# EAGLE design HDD (EAGLE 7.1.0)
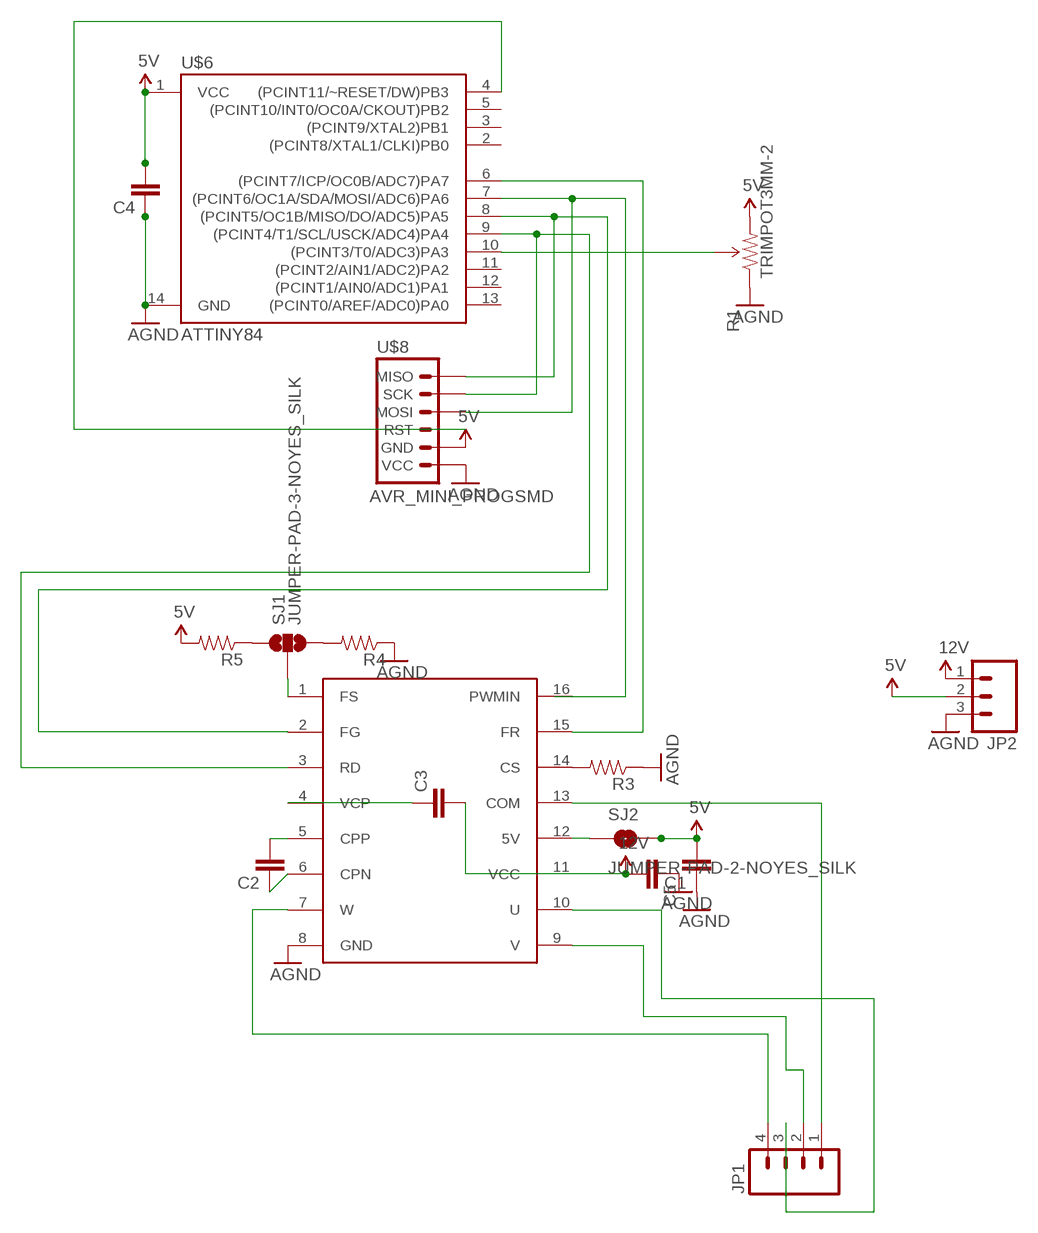
[diagram p0: schematic, sheet 1]

## Parts
C1  CAP0805  [0805]
C2  CAP0805  [0805]
C3  CAP0805  [0805]
C4  CAP0805  [0805]
C5  CAP0805  [0805]
JP1  M04LOCK  [1X04_LOCK]
JP2  M03PTH  [1X03]
R1  TRIMPOT3MM-2  [TRIMPOT-3MM-2]
R3  RESISTOR0805-RES  [0805]
R4  RESISTOR0805-RES  [0805]
R5  RESISTOR0805-RES  [0805]
SJ1  JUMPER-PAD-3-NOYES_SILK  [PAD-JUMPER-3-NO_YES_SILK]
SJ2  JUMPER-PAD-2-NOYES_SILK  [PAD-JUMPER-2-NO_YES_SILK]
U$1  DRV11873  [TSSOP-16]
U$6  ATTINY84  [SO14]
U$8  AVR_MINI_PROGSMD  [AVR_MINI_PROG]

## Nets
5V: C1.2 C4.2 JP2.2 R1.3(CW) R5.2 SJ2.2 U$6.1(VCC) U$8.2(GND)
12V: C3.2 C5.2 JP2.1 U$1.11(VCC)
AGND: C1.1 C4.1 C5.1 JP2.3 R1.1(CCW) R3.1 R4.1 U$1.8(GND) U$6.14(GND) U$8.1(VCC)
N$1: SJ2.1 U$1.12(5V)
N$3: C2.1 U$1.6(CPN)
N$4: C2.2 U$1.5(CPP)
N$5: U$1.2(FG) U$6.8((PCINT5/OC1B/MISO/DO/ADC5)PA5) U$8.6(MISO)
N$6: C3.1 U$1.4(VCP)
N$7: U$1.3(RD) U$6.9((PCINT4/T1/SCL/USCK/ADC4)PA4) U$8.5(SCK)
N$8: R3.2 U$1.14(CS)
N$9: JP1.1 U$1.13(COM)
N$10: JP1.3 U$1.10(U)
N$11: JP1.2 U$1.9(V)
N$12: JP1.4 U$1.7(W)
N$13: U$6.7((PCINT6/OC1A/SDA/MOSI/ADC6)PA6) U$8.4(MOSI)
N$14: U$1.15(FR) U$6.6((PCINT7/ICP/OC0B/ADC7)PA7)
N$15: SJ1.2 U$1.1(FS)
N$16: R4.2 SJ1.3
N$17: R5.1 SJ1.1
N$19: U$6.4((PCINT11/~RESET/DW)PB3) U$8.3(RST)
N$20: R1.2(WIPER) U$6.10((PCINT3/T0/ADC3)PA3)
Unconnected: U$1.16(PWMIN) U$6.2((PCINT8/XTAL1/CLKI)PB0) U$6.3((PCINT9/XTAL2)PB1) U$6.5((PCINT10/INT0/OC0A/CKOUT)PB2) U$6.11((PCINT2/AIN1/ADC2)PA2) U$6.12((PCINT1/AIN0/ADC1)PA1) U$6.13((PCINT0/AREF/ADC0)PA0)

## Library data of the parts
C1-C5 = SparkFun-Capacitors:CAP: Capacitor Standard 0603 ceramic capacitor, and 0.1" leaded capacitor.
JP1 = SparkFun-Connectors:M04: Header 4 Standard 4-pin 0.1" header. Use with straight break away headers (SKU : PRT-00116), right angle break away headers (PRT-00553), swiss pins (PRT-00743), machine pins (PRT-00117), and female headers (PRT-00115). Molex polarized connector foot print use with SKU : PRT-08231 with associated crimp pins and housings. 1MM SMD Version SKU: PRT-10208
JP2 = SparkFun-Connectors:M03: Header 3 Standard 3-pin 0.1" header. Use with straight break away headers (SKU : PRT-00116), right angle break away headers (PRT-00553), swiss pins (PRT-00743), machine pins (PRT-00117), and female headers (PRT-00115). Molex polarized connector foot print use with SKU : PRT-08232 with associated crimp pins and housings.
R1 = SparkFun-Electromechanical:TRIMPOT: Various small potentiometers for "set-and-forget" applications
R3-R5 = SparkFun-Resistors:RESISTOR: Resistor Basic schematic elements and footprints for 0603, 1206, and PTH resistors.
SJ1 = SparkFun-Passives:JUMPER-PAD-3-NO
SJ2 = SparkFun-Passives:JUMPER-PAD-2-NO
U$1 = SparkFun-PowerIC:DRV11873
U$6 = SparkFun-DigitalIC:ATTINY84: Atmel 14-pin 2/4/8kB flash uC; PROD_ID: IC-11285
U$8 = SparkFun-Connectors:AVR_MINI_PROG: AVR ISP 6-pin inline header

## Net classes
0 default: width 0.254 mm

## Board
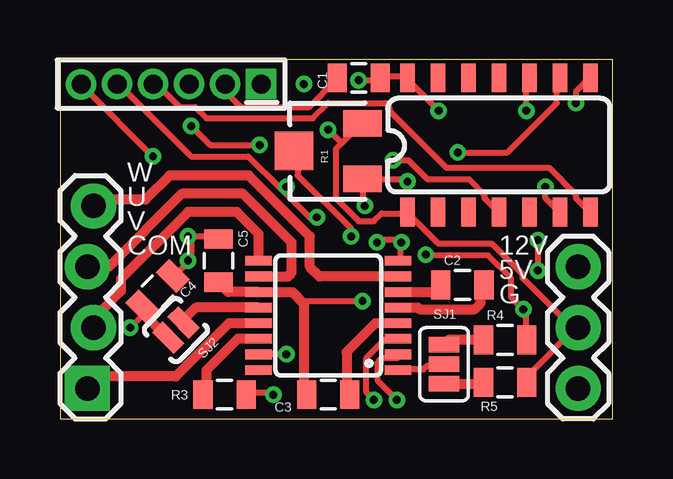
[diagram p1: board, top side]
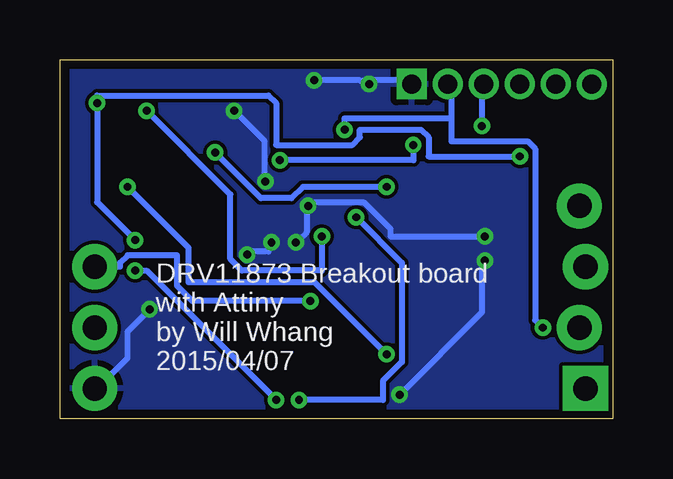
[diagram p2: board, bottom side, seen from below]

Size 23.04 x 14.98 mm. Coordinates in mm from the lower left corner, seen from the top.
Outline: 0,0 23.04,0 23.04,14.98 0,14.98 0,0
Copper layers (1*16): Top 0.0356mm / dielectric 1.5011mm / Bottom 0.0356mm
Design rules "LaenPCBOrder *": minimum track width 6mil, minimum drill 13mil, track to track 6mil, track to pad 6mil, pad to pad 6mil, via to via 6mil, smd to smd 6mil, copper to edge 15mil, drill to drill 6mil, minimum pad ring 7mil, minimum via ring 7mil, stop-mask expansion 3mil, vias tented up to drill 13mil, thermal gap 10mil

### Footprints (pad centres in the part's own frame; a part is rotated, then mirrored left to right if it is on the bottom)
0805 = smd 0.8 x 1.2: 1 -0.9,0; 2 0.9,0
1X04_LOCK = drill 1.016 pad 1.88 square: 1 0,0.127 | drill 1.016 pad 1.88: 2 2.54,-0.127; 3 5.08,0.127; 4 7.62,-0.127
1X03 = drill 1.016 pad 1.88: 1 0,0; 2 2.54,0; 3 5.08,0
TRIMPOT-3MM-2 = smd 1.092 x 1.6: 1 -1.155,-1.421; 3 1.155,-1.421 | smd 1.6 x 1.6: 2 0,1.421
PAD-JUMPER-3-NO_YES_SILK = smd 0.635 x 1.27: 1 -0.813,0; 2 0,0; 3 0.813,0
PAD-JUMPER-2-NO_YES_SILK = smd 0.635 x 1.27: 1 -0.45,0; 2 0.45,0
TSSOP-16 = smd 0.4 x 1.1: 1 -2.275,-2.9; 2 -1.625,-2.9; 3 -0.975,-2.9; 4 -0.325,-2.9; 5 0.325,-2.9; 6 0.975,-2.9; 7 1.625,-2.9; 8 2.275,-2.9; 9 2.275,2.9; 10 1.625,2.9; 11 0.975,2.9; 12 0.325,2.9; 13 -0.325,2.9; 14 -0.975,2.9; 15 -1.625,2.9; 16 -2.275,2.9
SO14 = smd 0.6 x 1.2: 1 -3.81,-2.8; 2 -2.54,-2.8; 3 -1.27,-2.8; 4 0,-2.8; 5 1.27,-2.8; 6 2.54,-2.8; 7 3.81,-2.8; 8 3.81,2.8; 9 2.54,2.8; 10 1.27,2.8; 11 0,2.8; 12 -1.27,2.8; 13 -2.54,2.8; 14 -3.81,2.8
AVR_MINI_PROG = drill 0.8 pad 1.27 square: 1 0,0 | drill 0.8 pad 1.27: 2 1.5,0; 3 3,0; 4 4.5,0; 5 6,0; 6 7.5,0.01

### Placement (x,y rotation side)
C1  12.45,14.22 180 top
C2  16.76,5.59 0 top
C3  11.18,1.02 180 top
C4  4.06,5.33 225 top
C5  6.6,6.6 270 top
JP1  1.27,1.27 90 top
JP2  21.59,6.35 270 top
R1  11.18,11.18 90 top
R3  6.86,1.02 180 top
R4  18.54,3.3 180 top
R5  18.54,1.52 0 top
SJ1  16,2.29 90 top
SJ2  4.83,3.7 225 top
U$1  11.18,4.32 90 top
U$6  18.29,11.43 0 top
U$8  8.38,13.97 180 top

### Tracks (layer width: path | path; a pad name or v marks a point on that pad's centre or on a via)
5V  (via drill 0.33)
  Top 0.254: C1.2 11.49,14.13 10.38,13.02 7.53,13.02 6.89,13.65 U$8.2 | v2.92,3.81 3.4,4.29 C4.2 | 11.73,11.51 12.45,12.22 R1.3 | 11.73,11.51 11.49,11.27 11.49,9.21 12.45,8.26 13.08,8.26 13.4,8.57 14.35,8.57 U$6.1 14.51,8.57 15.78,7.3 18,7.3 19.27,6.03 19.27,5.87 21.34,3.81 JP2.2 21.5,3.81 19.59,1.91 19.59,1.59 R5.2 | 11.73,11.51 v11.18,12.06
  Top 0.406: SJ2.2 4.49,3.39 3.56,4.32 3.56,4.83 C4.2
  Bottom 0.254: v2.92,3.81 3.24,4.13 3.24,11.27 3.56,11.59 6.73,11.59 6.73,12.54 | 6.73,12.54 6.73,13.97 U$8.2 | 6.73,12.54 11.18,12.54 v11.18,12.06
12V  (via drill 0.33)
  Top 0.254: v12.61,4.92 10.22,4.92 10.16,4.83
  Top 0.406: C5.2 7.02,5.29 U$1.11 9.69,5.29 10.16,4.83 10.16,1.13 C3.2
  Bottom 0.254: JP2.1 20.54,6.35 20.54,6.51 20.23,6.83 18.16,6.83 18.16,5.56 17.53,4.92 v12.61,4.92
AGND  (via drill 0.33)
  Top 0.254: v8.89,1.02 8.79,1.11 7.84,1.11 R3.1 | 4.67,6.03 C4.1 4.83,6.03 5.3,6.51 v5.33,6.6 5.46,6.67 5.46,7.62 v5.33,7.62 6.57,7.62 C5.1 | v12.45,14.13 13.24,14.13 C1.1 13.4,14.29 14.35,14.29 U$6.14 14.51,14.13 v15.78,12.86 | v13.21,7.37 13.24,7.46 14.19,7.46 v14.22,7.37 14.19,7.3 14.19,6.67 U$1.8 | 12.61,10 12.61,8.89 v12.7,8.89 | 12.61,10 14.35,10 v14.48,9.91 | 12.61,10 R1.1 | R4.1 19.43,3.65 19.43,4.45 v19.3,4.57 18.8,5.08 18.8,5.87 17.84,6.83 15.3,6.83 v15.24,6.86
  Top 0.406: R4.1 19.44,3.42 19.3,3.56
  Bottom 0.254: v8.89,1.02 5.46,4.45 5.46,6.51 v5.33,6.6 | U$8.1 8.48,13.97 8.48,14.13 10.38,14.13 v10.16,13.97 10.54,14.13 v12.45,14.13 | v15.24,6.86 15.14,6.99 14.35,6.99 14.35,7.3 v14.22,7.37 | v13.21,7.37 13.08,7.46 12.76,7.78 12.76,8.89 v12.7,8.89 12.61,8.89 12.61,9.05 10.38,9.05 9.27,7.94 9.27,7.62 v5.33,7.62 | v19.3,4.57 20.23,3.65 20.23,2.54 21.5,1.27 JP2.3 | v15.78,12.86 14.51,11.59 14.51,10 v14.48,9.91
  pour Bottom: 27.94,15.75 -2.54,15.75 -2.54,-1.02 27.94,-1.27
N$1
  Top 0.406: U$1.12 5.66,4.64 5.08,4.06 SJ2.1
N$3
  Top 0.406: U$1.6 15.57,5.29 C2.1
N$4
  Top 0.406: U$1.5 14.91,4.64 14.99,4.57 17.27,4.57 17.53,4.83 17.53,5.45 C2.2
N$5  (via drill 0.33)
  Top 0.254: v14.03,0.79 13.24,1.59 13.24,2.38 13.4,2.54 14.03,2.54 U$1.2 | v19.91,7.46 v19.91,6.19 | v21.5,13.18 21.5,13.65 21.97,14.13 U$6.8 | v3.87,10.95 1.02,13.81 U$8.6
  Bottom 0.254: v14.03,0.79 19.43,6.19 v19.91,6.19 | v19.91,7.46 21.5,9.05 v21.5,13.18 21.5,13.49 14.35,13.49 14.03,13.18 14.03,11.43 10.86,11.43 10.54,11.75 10.54,12.06 8,12.06 7.68,11.75 7.68,10.95 v3.87,10.95
N$6
  Top 0.406: 12.19,1.02 C3.1 11.94,1.15 11.94,2.79 13.14,3.99 U$1.4
N$7  (via drill 0.33)
  Top 0.254: v13.08,0.79 12.76,1.11 12.76,2.54 13.56,3.33 14.03,3.33 U$1.3 | v10.7,8.41 10.38,8.41 9.19,9.6 | 9.19,9.6 7.84,10.95 5.46,10.95 2.45,13.97 U$8.5 | v16.57,11.11 18.64,11.11 20.7,13.18 20.7,14.13 U$6.9 | v9.43,9.68 9.27,9.68 9.19,9.6
  Bottom 0.254: v13.08,0.79 9.59,0.79 9.59,1.59 8.79,2.38 8.79,6.51 v10.7,8.41 | v16.57,11.11 14.67,9.21 13.4,9.21 12.92,9.68 v9.43,9.68
N$8
  Top 0.406: U$1.14 7.41,3.34 6.1,2.03 6.1,1.15 R3.2
N$9
  Top 0.406: U$1.13 7.04,3.99 4.83,1.78 1.65,1.78 JP1.1
N$10
  Top 0.406: U$1.10 9.5,5.94 9.65,6.1 9.65,7.37 7.62,9.4 5.08,9.4 2.03,6.35 JP1.3
N$11
  Top 0.406: U$1.9 8.28,7.73 7.37,8.64 5.33,8.64 2.54,5.84 2.54,5.33 1.52,4.32 1.52,3.94 JP1.2 1.27,3.81
N$12
  Top 0.406: U$1.7 10.82,5.94 10.41,6.35 10.41,7.62 7.87,10.16 4.57,10.16 3.56,9.14 1.65,9.14 JP1.4
N$13
  Top 0.254: U$6.7 21.97,8.73 21.5,9.21 21.5,9.37 20.38,10.48 16.1,10.48 13.72,12.86 13.72,13.02 13.56,13.18 11.18,13.18 10.54,12.54 6.1,12.54 5.62,13.02 4.98,13.02 4.03,13.97 U$8.4
N$14  (via drill 0.33)
  Top 0.254: v9.43,2.7 8.32,2.7 U$1.15 | v20.23,9.68 20.23,9.21 20.7,8.73 U$6.6
  Bottom 0.254: v9.43,2.7 12.45,5.71 17.68,5.71 17.68,7.14 v20.23,9.68
N$15
  Top 0.254: U$1.1 14.19,2.06 15.14,2.06 15.3,2.22 15.94,2.22 SJ1.2
N$16
  Top 0.406: R4.2 16.2,3.3 SJ1.3
N$17
  Top 0.406: SJ1.1 17.59,1.47 R5.1
N$19  (via drill 0.33)
  Top 0.254: v13.88,10.79 14.51,10.79 15.3,10 17.05,10 17.68,9.37 17.68,9.21 18.16,8.73 U$6.4 | v8.32,11.43 6.26,11.43 v5.46,12.22
  Bottom 0.254: v13.88,10.79 8.32,10.79 v8.32,11.43 | v5.46,12.22 5.46,13.97 U$8.3
N$20  (via drill 0.33)
  Top 0.254: v19.43,12.86 19.43,14.13 U$6.10 | v12.13,7.62 12.13,7.94 9.91,10.16 9.91,11.11 R1.2
  Bottom 0.254: v19.43,12.86 15.94,9.37 15.94,6.67 15.46,6.19 12.13,6.19 v12.13,7.62

### Text on the board
tPlace: W | U | V | COM | 12V | 5V | G
bPlace: DRV11873 Breakout board / with Attiny / by Will Whang / 2015/04/07